# Altium project STM32最小系统.PrjPCB
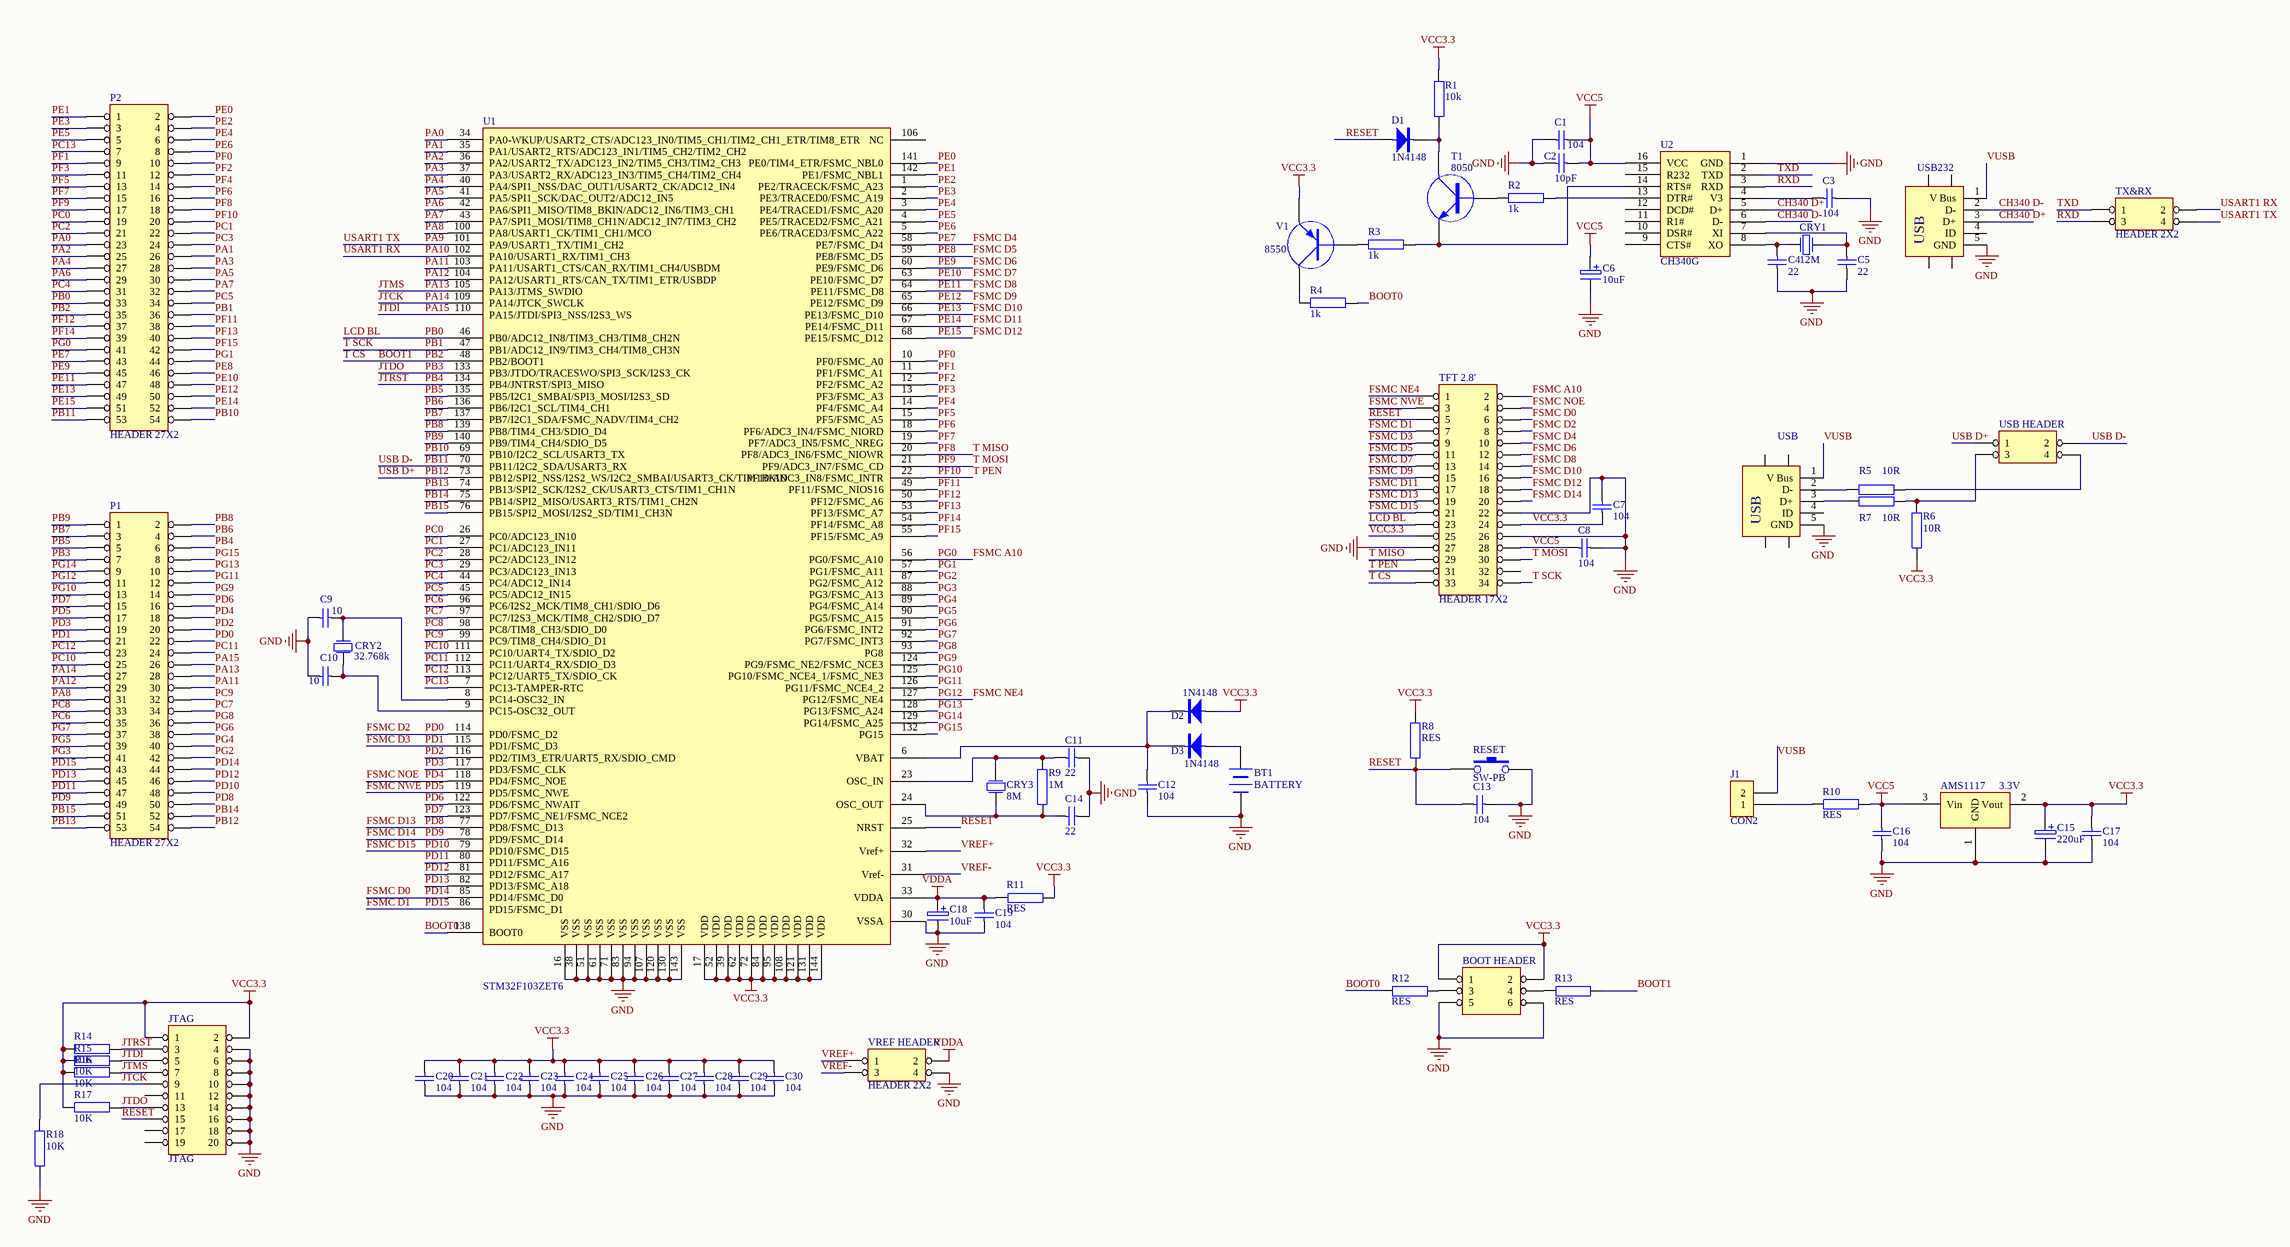
[diagram p0: STM32最小系统.SchDoc]
1 sheet, 72 parts. Net scope: global (net labels, ports and power ports of the same name join across sheets).
Board file: STM32最小系统.PcbDoc

## Sheet STM32最小系统.SchDoc
size A2

### Parts
AMS1117  3.3V  [SOT-223]
BOOT_HEADER  HEADER 3X2  [3X2DIP]  (value not drawn)
BT1  BATTERY  [POWER1]
C1  104  [C0805]
C2  10pF  [C0805]
C3  104  [C0805]
C4  22  [C0805]
C5  22  [C0805]
C6  10uF  [CAO1]
C7  104  [C0805]
C8  104  [C0805]
C9  10  [C0805]
C10  10  [C0805]
C11  22  [C0805]
C12  104  [C0805]
C13  104  [C0805]
C14  22  [C0805]
C15  220uF  [CAO1]
C16  104  [C0805]
C17  104  [C0805]
C18  10uF  [CAO1]
C19  104  [C0805]
C20  104  [C0805]
C21  104  [C0805]
C22  104  [C0805]
C23  104  [C0805]
C24  104  [C0805]
C25  104  [C0805]
C26  104  [C0805]
C27  104  [C0805]
C28  104  [C0805]
C29  104  [C0805]
C30  104  [C0805]
CRY1  12M  [JZ1]
CRY2  32.768k  [JZ_O1]
CRY3  8M  [JZ1]
D1  1N4148  [DIODE0.4]
D2  1N4148  [DIODE0.4]
D3  1N4148  [DIODE0.4]
J1  CON2  [sip-2]
JTAG  JTAG  [10x2DIP]
P1  HEADER 27X2  [27X2DIP]
P2  HEADER 27X2  [27X2DIP]
R1  10k  [R0805]
R2  1k  [R0805]
R3  1k  [R0805]
R4  1k  [R0805]
R5  10R  [R0805]
R6  10R  [R0805]
R7  10R  [R0805]
R8  RES  [R0805]
R9  1M  [R0805]
R10  RES  [R0805]
R11  RES  [R0805]
R12  RES  [R0805]
R13  RES  [R0805]
R14  10K  [R0805]
R15  10K  [R0805]
R16  10K  [R0805]
R17  10K  [R0805]
R18  10K  [R0805]
RESET  SW-PB  [按键 15mm*15mm]
T1  8050  [TO-92]
TFT_2.8'  HEADER 17X2  [17X2DIP]
TX&RX  HEADER 2X2  [2X2DIP]
U1  STM32F103ZET6  [LQFN144]
U2  CH340G  [SOP16]
USB  (no value)  [USB_mini_B]
USB232  (no value)  [USB_mini_B]
USB_HEADER  (no value)  [2X2DIP]
V1  8550  [TO-92]
VREF_HEADER  HEADER 2X2  [2X2DIP]

### Nets
GND: AMS1117.1(GND) BOOT_HEADER.5 BOOT_HEADER.6 BT1.2(-) C1.1 C2.1 C3.2 C4.2 C5.2 C6.2 C7.1 C8.1 C9.1 C10.1 C11.1 C12.1 C13.1 C14.1 C15.2 C16.1 C17.1 C18.2 C19.1 C20.1 C21.1 C22.1 C23.1 C24.1 C25.1 C26.1 C27.1 C28.1 C29.1 C30.1 JTAG.4 JTAG.6 JTAG.8 JTAG.10 JTAG.12 JTAG.14 JTAG.16 JTAG.18 JTAG.20 R18.1 RESET.2 TFT_2.8'.22 TFT_2.8'.26 TFT_2.8'.27 U1.16(VSS) U1.30(VSSA) U1.38(VSS) U1.51(VSS) U1.61(VSS) U1.71(VSS) U1.83(VSS) U1.94(VSS) U1.107(VSS) U1.120(VSS) U1.130(VSS) U1.143(VSS) U2.1(GND) USB.5(GND) USB232.5(GND) VREF_HEADER.4
VCC3.3: AMS1117.2(Vout) BOOT_HEADER.1 BOOT_HEADER.2 C7.2 C15.1 C17.2 C20.2 C21.2 C22.2 C23.2 C24.2 C25.2 C26.2 C27.2 C28.2 C29.2 C30.2 D2.1 JTAG.1 JTAG.2 R1.1 R6.1 R8.2 R11.2 R14.2 R15.2 R16.2 R17.2 TFT_2.8'.24 TFT_2.8'.25 U1.17(VDD) U1.39(VDD) U1.52(VDD) U1.62(VDD) U1.72(VDD) U1.84(VDD) U1.95(VDD) U1.108(VDD) U1.121(VDD) U1.131(VDD) U1.144(VDD) V1.1(E)
VCC5: AMS1117.3(Vin) C1.2 C2.2 C6.1 C8.2 C16.2 R10.1 TFT_2.8'.28 U2.16(VCC)
VDDA: C18.1 C19.2 R11.1 U1.33(VDDA) VREF_HEADER.2
BOOT0: R4.1 R12.1 U1.138(BOOT0)
BOOT1: P2.35 R13.2 TFT_2.8'.33 U1.48(PB2/BOOT1)  [also labelled PB2, T CS]
CH340 D+: U2.5(D+) USB232.3(D+)
CH340 D-: U2.6(D-) USB232.2(D-)
FSMC A10: P2.41 TFT_2.8'.2 U1.56(PG0/FSMC_A10)  [also labelled PG0]
FSMC D0: P1.44 TFT_2.8'.6 U1.85(PD14/FSMC_D0)  [also labelled PD14]
FSMC D1: P1.43 TFT_2.8'.7 U1.86(PD15/FSMC_D1)  [also labelled PD15]
FSMC D2: P1.22 TFT_2.8'.8 U1.114(PD0/FSMC_D2)  [also labelled PD0]
FSMC D3: P1.21 TFT_2.8'.9 U1.115(PD1/FSMC_D3)  [also labelled PD1]
FSMC D4: P2.43 TFT_2.8'.10 U1.58(PE7/FSMC_D4)  [also labelled PE7]
FSMC D5: P2.46 TFT_2.8'.11 U1.59(PE8/FSMC_D5)  [also labelled PE8]
FSMC D6: P2.45 TFT_2.8'.12 U1.60(PE9/FSMC_D6)  [also labelled PE9]
FSMC D7: P2.48 TFT_2.8'.13 U1.63(PE10/FSMC_D7)  [also labelled PE10]
FSMC D8: P2.47 TFT_2.8'.14 U1.64(PE11/FSMC_D8)  [also labelled PE11]
FSMC D9: P2.50 TFT_2.8'.15 U1.65(PE12/FSMC_D9)  [also labelled PE12]
FSMC D10: P2.49 TFT_2.8'.16 U1.66(PE13/FSMC_D10)  [also labelled PE13]
FSMC D11: P2.52 TFT_2.8'.17 U1.67(PE14/FSMC_D11)  [also labelled PE14]
FSMC D12: P2.51 TFT_2.8'.18 U1.68(PE15/FSMC_D12)  [also labelled PE15]
FSMC D13: P1.50 TFT_2.8'.19 U1.77(PD8/FSMC_D13)  [also labelled PD8]
FSMC D14: P1.49 TFT_2.8'.20 U1.78(PD9/FSMC_D14)  [also labelled PD9]
FSMC D15: P1.48 TFT_2.8'.21 U1.79(PD10/FSMC_D15)  [also labelled PD10]
FSMC NE4: P1.11 TFT_2.8'.1 U1.127(PG12/FSMC_NE4)  [also labelled PG12]
FSMC NOE: P1.18 TFT_2.8'.4 U1.118(PD4/FSMC_NOE)  [also labelled PD4]
FSMC NWE: P1.17 TFT_2.8'.3 U1.119(PD5/FSMC_NWE)  [also labelled PD5]
JTCK: JTAG.9 P1.27 R18.2 U1.109(PA14/JTCK_SWCLK)  [also labelled PA14]
JTDI: JTAG.5 P1.26 R15.1 U1.110(PA15/JTDI/SPI3_NSS/I2S3_WS)  [also labelled PA15]
JTDO: JTAG.13 P1.7 R17.1 U1.133(PB3/JTDO/TRACESWO/SPI3_SCK/I2S3_CK)  [also labelled PB3]
JTMS: JTAG.7 P1.28 R16.1 U1.105(PA13/JTMS_SWDIO)  [also labelled PA13]
JTRST: JTAG.3 P1.6 R14.1 U1.134(PB4/JNTRST/SPI3_MISO)  [also labelled PB4]
LCD BL: P2.33 TFT_2.8'.23 U1.46(PB0/ADC12_IN8/TIM3_CH3/TIM8_CH2N)  [also labelled PB0]
PA0: P2.23 U1.34(PA0-WKUP/USART2_CTS/ADC123_IN0/TIM5_CH1/TIM2_CH1_ETR/TIM8_ETR)
PA1: P2.26 U1.35(PA1/USART2_RTS/ADC123_IN1/TIM5_CH2/TIM2_CH2)
PA2: P2.25 U1.36(PA2/USART2_TX/ADC123_IN2/TIM5_CH3/TIM2_CH3)
PA3: P2.28 U1.37(PA3/USART2_RX/ADC123_IN3/TIM5_CH4/TIM2_CH4)
PA4: P2.27 U1.40(PA4/SPI1_NSS/DAC_OUT1/USART2_CK/ADC12_IN4)
PA5: P2.30 U1.41(PA5/SPI1_SCK/DAC_OUT2/ADC12_IN5)
PA6: P2.29 U1.42(PA6/SPI1_MISO/TIM8_BKIN/ADC12_IN6/TIM3_CH1)
PA7: P2.32 U1.43(PA7/SPI1_MOSI/TIM8_CH1N/ADC12_IN7/TIM3_CH2)
PA8: P1.31 U1.100(PA8/USART1_CK/TIM1_CH1/MCO)
PA9: TX&RX.4 U1.101(PA9/USART1_TX/TIM1_CH2)  [also labelled USART1 TX]
PA10: TX&RX.2 U1.102(PA10/USART1_RX/TIM1_CH3)  [also labelled USART1 RX]
PA11: P1.30 U1.103(PA11/USART1_CTS/CAN_RX/TIM1_CH4/USBDM)
PA12: P1.29 U1.104(PA12/USART1_RTS/CAN_TX/TIM1_ETR/USBDP)
PB1: P2.36 TFT_2.8'.34 U1.47(PB1/ADC12_IN9/TIM3_CH4/TIM8_CH3N)  [also labelled T SCK]
PB5: P1.5 U1.135(PB5/I2C1_SMBAI/SPI3_MOSI/I2S3_SD)
PB6: P1.4 U1.136(PB6/I2C1_SCL/TIM4_CH1)
PB7: P1.3 U1.137(PB7/I2C1_SDA/FSMC_NADV/TIM4_CH2)
PB8: P1.2 U1.139(PB8/TIM4_CH3/SDIO_D4)
PB9: P1.1 U1.140(PB9/TIM4_CH4/SDIO_D5)
PB10: P2.54 U1.69(PB10/I2C2_SCL/USART3_TX)
PB11: P2.53 U1.70(PB11/I2C2_SDA/USART3_RX) USB_HEADER.2  [also labelled USB D-]
PB12: P1.54 U1.73(PB12/SPI2_NSS/I2S2_WS/I2C2_SMBAI/USART3_CK/TIM1BKIN) USB_HEADER.1  [also labelled USB D+]
PB13: P1.53 U1.74(PB13/SPI2_SCK/I2S2_CK/USART3_CTS/TIM1_CH1N)
PB14: P1.52 U1.75(PB14/SPI2_MISO/USART3_RTS/TIM1_CH2N)
PB15: P1.51 U1.76(PB15/SPI2_MOSI/I2S2_SD/TIM1_CH3N)
PC0: P2.19 U1.26(PC0/ADC123_IN10)
PC1: P2.22 U1.27(PC1/ADC123_IN11)
PC2: P2.21 U1.28(PC2/ADC123_IN12)
PC3: P2.24 U1.29(PC3/ADC123_IN13)
PC4: P2.31 U1.44(PC4/ADC12_IN14)
PC5: P2.34 U1.45(PC5/ADC12_IN15)
PC6: P1.35 U1.96(PC6/I2S2_MCK/TIM8_CH1/SDIO_D6)
PC7: P1.34 U1.97(PC7/I2S3_MCK/TIM8_CH2/SDIO_D7)
PC8: P1.33 U1.98(PC8/TIM8_CH3/SDIO_D0)
PC9: P1.32 U1.99(PC9/TIM8_CH4/SDIO_D1)
PC10: P1.25 U1.111(PC10/UART4_TX/SDIO_D2)
PC11: P1.24 U1.112(PC11/UART4_RX/SDIO_D3)
PC12: P1.23 U1.113(PC12/UART5_TX/SDIO_CK)
PC13: P2.7 U1.7(PC13-TAMPER-RTC)
PD2: P1.20 U1.116(PD2/TIM3_ETR/UART5_RX/SDIO_CMD)
PD3: P1.19 U1.117(PD3/FSMC_CLK)
PD6: P1.16 U1.122(PD6/FSMC_NWAIT)
PD7: P1.15 U1.123(PD7/FSMC_NE1/FSMC_NCE2)
PD11: P1.47 U1.80(PD11/FSMC_A16)
PD12: P1.46 U1.81(PD12/FSMC_A17)
PD13: P1.45 U1.82(PD13/FSMC_A18)
PE0: P2.2 U1.141(PE0/TIM4_ETR/FSMC_NBL0)
PE1: P2.1 U1.142(PE1/FSMC_NBL1)
PE2: P2.4 U1.1(PE2/TRACECK/FSMC_A23)
PE3: P2.3 U1.2(PE3/TRACED0/FSMC_A19)
PE4: P2.6 U1.3(PE4/TRACED1/FSMC_A20)
PE5: P2.5 U1.4(PE5/TRACED2/FSMC_A21)
PE6: P2.8 U1.5(PE6/TRACED3/FSMC_A22)
PF0: P2.10 U1.10(PF0/FSMC_A0)
PF1: P2.9 U1.11(PF1/FSMC_A1)
PF2: P2.12 U1.12(PF2/FSMC_A2)
PF3: P2.11 U1.13(PF3/FSMC_A3)
PF4: P2.14 U1.14(PF4/FSMC_A4)
PF5: P2.13 U1.15(PF5/FSMC_A5)
PF6: P2.16 U1.18(PF6/ADC3_IN4/FSMC_NIORD)
PF7: P2.15 U1.19(PF7/ADC3_IN5/FSMC_NREG)
PF8: P2.18 TFT_2.8'.29 U1.20(PF8/ADC3_IN6/FSMC_NIOWR)  [also labelled T MISO]
PF9: P2.17 TFT_2.8'.30 U1.21(PF9/ADC3_IN7/FSMC_CD)  [also labelled T MOSI]
PF10: P2.20 TFT_2.8'.31 U1.22(PF10/ADC3_IN8/FSMC_INTR)  [also labelled T PEN]
PF11: P2.38 U1.49(PF11/FSMC_NIOS16)
PF12: P2.37 U1.50(PF12/FSMC_A6)
PF13: P2.40 U1.53(PF13/FSMC_A7)
PF14: P2.39 U1.54(PF14/FSMC_A8)
PF15: P2.42 U1.55(PF15/FSMC_A9)
PG1: P2.44 U1.57(PG1/FSMC_A11)
PG2: P1.42 U1.87(PG2/FSMC_A12)
PG3: P1.41 U1.88(PG3/FSMC_A13)
PG4: P1.40 U1.89(PG4/FSMC_A14)
PG5: P1.39 U1.90(PG5/FSMC_A15)
PG6: P1.38 U1.91(PG6/FSMC_INT2)
PG7: P1.37 U1.92(PG7/FSMC_INT3)
PG8: P1.36 U1.93(PG8)
PG9: P1.14 U1.124(PG9/FSMC_NE2/FSMC_NCE3)
PG10: P1.13 U1.125(PG10/FSMC_NCE4_1/FSMC_NE3)
PG11: P1.12 U1.126(PG11/FSMC_NCE4_2)
PG13: P1.10 U1.128(PG13/FSMC_A24)
PG14: P1.9 U1.129(PG14/FSMC_A25)
PG15: P1.8 U1.132(PG15)
RESET: C13.2 D1.1 JTAG.15 R8.1 RESET.1 TFT_2.8'.5 U1.25(NRST)
RXD: TX&RX.3 U2.3(RXD)
TXD: TX&RX.1 U2.2(TXD)
VREF+: U1.32(Vref+) VREF_HEADER.1
VREF-: U1.31(Vref-) VREF_HEADER.3
VUSB: J1.2 USB.1(V_Bus) USB232.1(V_Bus)
NetBOOT_HEADER_3: BOOT_HEADER.3 R12.2
NetBOOT_HEADER_4: BOOT_HEADER.4 R13.1
NetBT1_1: BT1.1(+) D3.1
NetC3_1: C3.1 U2.4(V3)
NetC4_1: C4.1 CRY1.1(P1) U2.8(XO)
NetC5_1: C5.1 CRY1.2(P2) U2.7(XI)
NetC9_2: C9.2 CRY2.1(P1) U1.8(PC14-OSC32_IN)
NetC10_2: C10.2 CRY2.2(P2) U1.9(PC15-OSC32_OUT)
NetC11_2: C11.2 CRY3.1(P1) R9.2 U1.23(OSC_IN)
NetC12_2: C12.2 D2.2 D3.2 U1.6(VBAT)
NetC14_2: C14.2 CRY3.2(P2) R9.1 U1.24(OSC_OUT)
NetD1_2: D1.2 R1.2 T1.3(C)
NetJ1_1: J1.1 R10.2
NetR2_1: R2.1 U2.13(DTR#)
NetR2_2: R2.2 T1.2(B)
NetR3_1: R3.1 T1.1(E) U2.14(RTS#)
NetR3_2: R3.2 V1.2(B)
NetR4_2: R4.2 V1.3(C)
NetR5_1: R5.1 USB.2(D-)
NetR5_2: R5.2 USB_HEADER.4
NetR6_2: R6.2 R7.2 USB_HEADER.3
NetR7_1: R7.1 USB.3(D+)

Not connected (* = marked no-connect by the designer): JTAG 11 17 19; TFT_2.8' 32; U1 106(NC); U2 9(CTS#) 10(DSR#) 11(R1#) 12(DCD#) 15(R232); USB 0 4(ID); USB232 0 4(ID)

### Notes on the sheet
- (in symbol USB_mini_B) USB

### Library data of the parts
AMS1117 = LD1117
C1-C5 C7-C14 C16 C17 C19-C30 = Cap: Capacitor; Published: 8-Jun-2000; LatestRevisionDate: 17-Jul-2002; LatestRevisionNote: Re-released for DXP Platform.; PackageReference: RAD-0.3; Publisher: Altium Limited
C6 C15 C18 = CAP3
CRY1-CRY3 = CRY1: 6.0000 8.000  11.0592  12.0000 24.000
D1-D3 = DIODE
J1 = CON2: Connector
JTAG = HEADER 10X2
R1-R7 R9 R14-R18 = RES
USB USB232 = USB_mini_B
USB_HEADER = HEADER 2X2